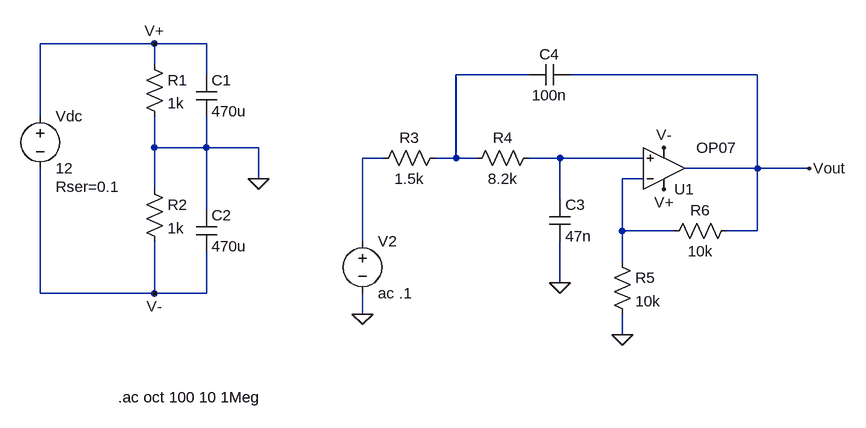
[diagram p0: schematic Sallen_Key_LPF_500Hz.asc]
Sallen_Key_LPF_500Hz.asc, the LTspice schematic file:
Version 4
SHEET 1 1236 820
WIRE -208 -112 -384 -112
WIRE -128 -112 -208 -112
WIRE -208 -80 -208 -112
WIRE -128 -64 -128 -112
WIRE 368 -64 256 -64
WIRE 720 -64 432 -64
WIRE -384 0 -384 -112
WIRE -208 48 -208 0
WIRE -128 48 -128 0
WIRE -128 48 -208 48
WIRE -48 48 -128 48
WIRE 144 64 112 64
WIRE 256 64 256 -64
WIRE 256 64 224 64
WIRE 288 64 256 64
WIRE 416 64 368 64
WIRE 544 64 416 64
WIRE 720 80 720 -64
WIRE 720 80 608 80
WIRE 800 80 720 80
WIRE -48 96 -48 48
WIRE 544 96 512 96
WIRE -208 112 -208 48
WIRE 416 128 416 64
WIRE -128 144 -128 48
WIRE 512 176 512 96
WIRE 592 176 512 176
WIRE 720 176 720 80
WIRE 720 176 672 176
WIRE 112 192 112 64
WIRE 512 224 512 176
WIRE 416 256 416 192
WIRE -384 272 -384 80
WIRE -208 272 -208 192
WIRE -208 272 -384 272
WIRE -128 272 -128 208
WIRE -128 272 -208 272
WIRE 112 304 112 272
WIRE 512 336 512 304
FLAG -48 96 0
FLAG 112 304 0
FLAG 512 336 0
FLAG 416 256 0
FLAG -208 -112 V+
FLAG -208 272 V-
FLAG 576 48 V-
FLAG 576 112 V+
FLAG 800 80 Vout
SYMBOL Opamps\\OP07 576 144 M180
WINDOW 3 50 96 Left 2
SYMATTR InstName U1
SYMBOL voltage -384 -16 R0
WINDOW 123 0 0 Left 2
WINDOW 39 24 124 Left 2
SYMATTR SpiceLine Rser=0.1
SYMATTR InstName Vdc
SYMATTR Value 12
SYMBOL voltage 112 176 R0
WINDOW 123 0 0 Left 2
WINDOW 39 0 0 Left 2
SYMATTR InstName V2
SYMATTR Value ac .1
SYMBOL res -224 -96 R0
SYMATTR InstName R1
SYMATTR Value 1k
SYMATTR SpiceLine tol=5 pwr=1
SYMBOL res -224 96 R0
SYMATTR InstName R2
SYMATTR Value 1k
SYMATTR SpiceLine tol=5 pwr=1
SYMBOL cap -144 -64 R0
SYMATTR InstName C1
SYMATTR Value 470u
SYMATTR SpiceLine V=10 Rser=0.2
SYMBOL cap -144 144 R0
SYMATTR InstName C2
SYMATTR Value 470u
SYMATTR SpiceLine V=10 Rser=0.2
SYMBOL res 240 48 R90
WINDOW 0 0 56 VBottom 2
WINDOW 3 32 56 VTop 2
SYMATTR InstName R3
SYMATTR Value 1.5k
SYMATTR SpiceLine tol=5 pwr=1
SYMBOL res 384 48 R90
WINDOW 0 0 56 VBottom 2
WINDOW 3 32 56 VTop 2
SYMATTR InstName R4
SYMATTR Value 8.2k
SYMATTR SpiceLine tol=5 pwr=1
SYMBOL cap 400 128 R0
SYMATTR InstName C3
SYMATTR Value 47n
SYMBOL cap 432 -80 R90
WINDOW 0 0 32 VBottom 2
WINDOW 3 32 32 VTop 2
SYMATTR InstName C4
SYMATTR Value 100n
SYMBOL res 496 208 R0
SYMATTR InstName R5
SYMATTR Value 10k
SYMATTR SpiceLine tol=5 pwr=1
SYMBOL res 688 160 R90
WINDOW 0 0 56 VBottom 2
WINDOW 3 32 56 VTop 2
SYMATTR InstName R6
SYMATTR Value 10k
SYMATTR SpiceLine tol=5 pwr=1
TEXT -264 432 Left 2 !.ac oct 100 10 1Meg

The netlist it stands for:
* Sallen_Key_LPF_500Hz.asc
XU1 N003 N004 V+ V- Vout LT1001  ; OP07, pins In+ In- V+ V- OUT
Vdc V+ V- 12 Rser=0.1
V2 N002 0 ac .1
R1 V+ 0 1k tol=5 pwr=1
R2 0 V- 1k tol=5 pwr=1
C1 V+ 0 470u V=10 Rser=0.2
C2 0 V- 470u V=10 Rser=0.2
R3 N001 N002 1.5k tol=5 pwr=1
R4 N003 N001 8.2k tol=5 pwr=1
C3 N003 0 47n
C4 Vout N001 100n
R5 N004 0 10k tol=5 pwr=1
R6 Vout N004 10k tol=5 pwr=1
.ac oct 100 10 1Meg
.lib LTC.lib
.backanno
.end